# EAGLE schematic power (EAGLE 6.4)
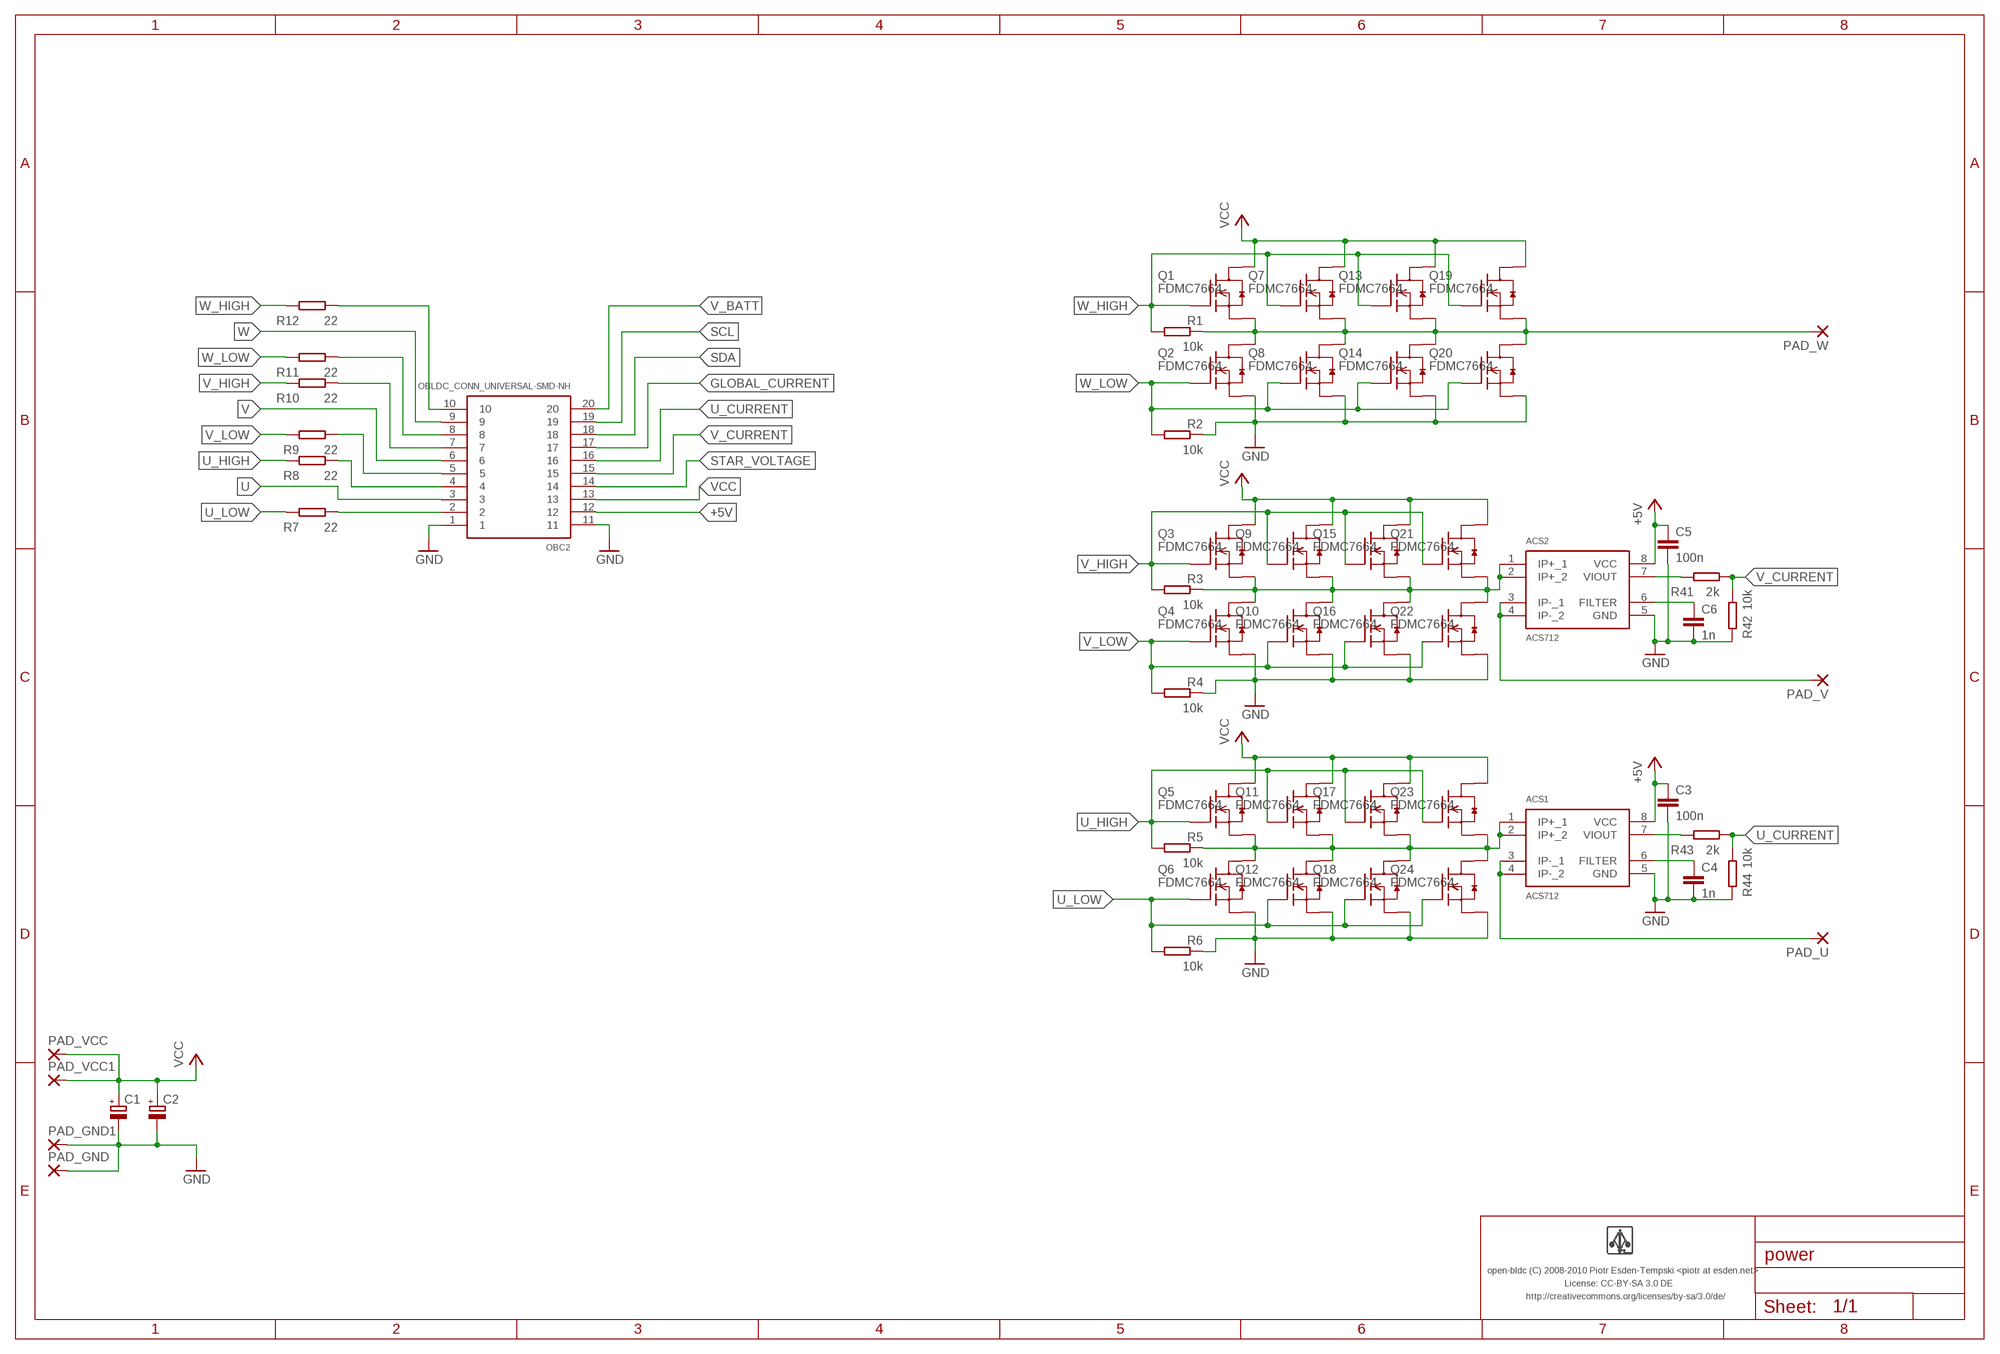
[diagram p0: schematic, sheet 1]

## Parts
ACS1  ACS712  [SO8]
ACS2  ACS712  [SO8]
C1  CPOL-EUE5-10.5  [E5-10,5]
C2  CPOL-EUE5-10.5  [E5-10,5]
C3  100n  CAPACITOR-0603  [0603-CAP]
C4  1n  CAPACITOR-0603  [0603-CAP]
C5  100n  CAPACITOR-0603  [0603-CAP]
C6  1n  CAPACITOR-0603  [0603-CAP]
OBC2  OBLDC_CONN_UNIVERSAL-SMD-NH  [OBLDC_CONN_SMD_NO_HOLES]
PAD_GND  WIREPAD-2MM  [WIREPAD_2MM]
PAD_GND1  WIREPAD-2MM  [WIREPAD_2MM]
PAD_U  WIREPAD-2MM  [WIREPAD_2MM]
PAD_V  WIREPAD-2MM  [WIREPAD_2MM]
PAD_VCC  WIREPAD-2MM  [WIREPAD_2MM]
PAD_VCC1  WIREPAD-2MM  [WIREPAD_2MM]
PAD_W  WIREPAD-2MM  [WIREPAD_2MM]
Q1  FDMC7664  [MLP33]
Q2  FDMC7664  [MLP33]
Q3  FDMC7664  [MLP33]
Q4  FDMC7664  [MLP33]
Q5  FDMC7664  [MLP33]
Q6  FDMC7664  [MLP33]
Q7  FDMC7664  [MLP33]
Q8  FDMC7664  [MLP33]
Q9  FDMC7664  [MLP33]
Q10  FDMC7664  [MLP33]
Q11  FDMC7664  [MLP33]
Q12  FDMC7664  [MLP33]
Q13  FDMC7664  [MLP33]
Q14  FDMC7664  [MLP33]
Q15  FDMC7664  [MLP33]
Q16  FDMC7664  [MLP33]
Q17  FDMC7664  [MLP33]
Q18  FDMC7664  [MLP33]
Q19  FDMC7664  [MLP33]
Q20  FDMC7664  [MLP33]
Q21  FDMC7664  [MLP33]
Q22  FDMC7664  [MLP33]
Q23  FDMC7664  [MLP33]
Q24  FDMC7664  [MLP33]
R1  10k  RESISTOR-0603  [0603-RES]
R2  10k  RESISTOR-0603  [0603-RES]
R3  10k  RESISTOR-0603  [0603-RES]
R4  10k  RESISTOR-0603  [0603-RES]
R5  10k  RESISTOR-0603  [0603-RES]
R6  10k  RESISTOR-0603  [0603-RES]
R7  22  RESISTOR-0603  [0603-RES]
R8  22  RESISTOR-0603  [0603-RES]
R9  22  RESISTOR-0603  [0603-RES]
R10  22  RESISTOR-0603  [0603-RES]
R11  22  RESISTOR-0603  [0603-RES]
R12  22  RESISTOR-0603  [0603-RES]
R41  2k  RESISTOR-0603  [0603-RES]
R42  10k  RESISTOR-0603  [0603-RES]
R43  2k  RESISTOR-0603  [0603-RES]
R44  10k  RESISTOR-0603  [0603-RES]
U$2  LOGO-NORM  [LOGO]

## Nets
+5V: ACS1.8(VCC) ACS2.8(VCC) C3.P$1 C5.P$1 OBC2.12
GLOBAL_CURRENT: OBC2.17
GND: ACS1.5(GND) ACS2.5(GND) C1.- C2.- C3.P$2 C4.P$2 C5.P$2 C6.P$2 OBC2.1 OBC2.11 PAD_GND1.1(P) PAD_GND.1(P) Q2.123S(S) Q4.123S(S) Q6.123S(S) Q8.123S(S) Q10.123S(S) Q12.123S(S) Q14.123S(S) Q16.123S(S) Q18.123S(S) Q20.123S(S) Q22.123S(S) Q24.123S(S) R2.P$1 R4.P$1 R6.P$1 R42.P$2 R44.P$2
N$1: ACS1.3(IP-_1) ACS1.4(IP-_2) PAD_U.1(P)
N$2: ACS2.6(FILTER) C6.P$1
N$3: ACS2.3(IP-_1) ACS2.4(IP-_2) PAD_V.1(P)
N$4: OBC2.2 R7.P$1
N$5: OBC2.4 R8.P$1
N$6: OBC2.5 R9.P$1
N$7: OBC2.7 R10.P$1
N$8: OBC2.8 R11.P$1
N$9: OBC2.10 R12.P$1
N$31: ACS1.6(FILTER) C4.P$1
N$32: ACS2.7(VIOUT) R41.P$2
N$35: ACS1.7(VIOUT) R43.P$2
SCL: OBC2.19
SDA: OBC2.18
STAR_VOLTAGE: OBC2.14
U: ACS1.1(IP+_1) ACS1.2(IP+_2) OBC2.3 Q5.123S(S) Q6.5678D(D) Q11.123S(S) Q12.5678D(D) Q17.123S(S) Q18.5678D(D) Q23.123S(S) Q24.5678D(D) R5.P$1
U_CURRENT: OBC2.16 R43.P$1 R44.P$1
U_HIGH: Q5.4G(G) Q11.4G(G) Q17.4G(G) Q23.4G(G) R5.P$2 R8.P$2
U_LOW: Q6.4G(G) Q12.4G(G) Q18.4G(G) Q24.4G(G) R6.P$2 R7.P$2
V: ACS2.1(IP+_1) ACS2.2(IP+_2) OBC2.6 Q3.123S(S) Q4.5678D(D) Q9.123S(S) Q10.5678D(D) Q15.123S(S) Q16.5678D(D) Q21.123S(S) Q22.5678D(D) R3.P$1
V_BATT: OBC2.20
V_CURRENT: OBC2.15 R41.P$1 R42.P$1
V_HIGH: Q3.4G(G) Q9.4G(G) Q15.4G(G) Q21.4G(G) R3.P$2 R10.P$2
V_LOW: Q4.4G(G) Q10.4G(G) Q16.4G(G) Q22.4G(G) R4.P$2 R9.P$2
VCC: C1.+ C2.+ OBC2.13 PAD_VCC1.1(P) PAD_VCC.1(P) Q1.5678D(D) Q3.5678D(D) Q5.5678D(D) Q7.5678D(D) Q9.5678D(D) Q11.5678D(D) Q13.5678D(D) Q15.5678D(D) Q17.5678D(D) Q19.5678D(D) Q21.5678D(D) Q23.5678D(D)
W: OBC2.9 PAD_W.1(P) Q1.123S(S) Q2.5678D(D) Q7.123S(S) Q8.5678D(D) Q13.123S(S) Q14.5678D(D) Q19.123S(S) Q20.5678D(D) R1.P$1
W_HIGH: Q1.4G(G) Q7.4G(G) Q13.4G(G) Q19.4G(G) R1.P$2 R12.P$2
W_LOW: Q2.4G(G) Q8.4G(G) Q14.4G(G) Q20.4G(G) R2.P$2 R11.P$2

## Notes on the sheet
- open-bldc (C) 2008-2010 Piotr Esden-Tempski <piotr at esden.net>
- License: CC-BY-SA 3.0 DE
- http://creativecommons.org/licenses/by-sa/3.0/de/

## Library data of the parts
ACS1 ACS2 = open-bldc:ACS712
C1 C2 = resistor:CPOL-EU: POLARIZED CAPACITOR, European symbol
C3-C6 = pel_dipol_comp:CAPACITOR
OBC2 = open-bldc:OBLDC_CONN_UNIVERSAL
PAD_GND PAD_GND1 PAD_U PAD_V PAD_VCC PAD_VCC1 PAD_W = open-bldc:WIREPAD: THROUGH-HOLE PAD
Q1-Q24 = open-bldc:FDMC7664
R1-R12 R41-R44 = pel_dipol_comp:RESISTOR
U$2 = open-bldc:LOGO